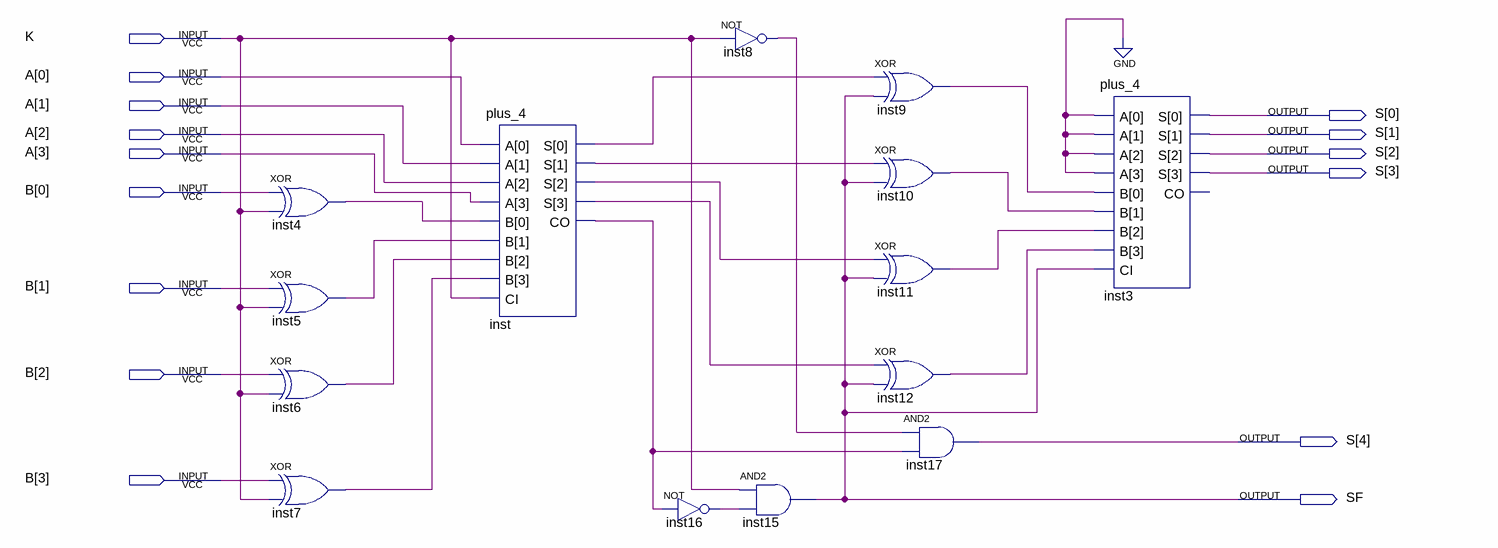
[diagram p0: schematic sheet]
// Quartus schematic plus_minus_final.bdf as structural Verilog: 14 symbols, 15 pins
module plus_minus_final (
  input  K,
  input  [3:0] A,
  input  [3:0] B,
  output [4:0] S,
  output SF
);

  wire inst4_out, inst5_out, inst6_out, inst7_out, inst8_out, inst9_out, inst10_out, inst11_out, inst12_out,
       inst16_out, inst_co, inst_s, inst_s_2, inst_s_3, inst_s_4;

  xor inst4 (inst4_out, B[0], K);
  xor inst5 (inst5_out, B[1], K);
  xor inst6 (inst6_out, B[2], K);
  xor inst7 (inst7_out, B[3], K);
  plus_4 inst (
    .A(A), .B({inst7_out, inst6_out, inst5_out, inst4_out}), .CI(K),
    .S({inst_s_3, inst_s_2, inst_s_4, inst_s}), .CO(inst_co));
  not inst16 (inst16_out, inst_co);
  not inst8 (inst8_out, K);
  and inst15 (SF, K, inst16_out);
  xor inst9 (inst9_out, inst_s, SF);
  xor inst10 (inst10_out, inst_s_4, SF);
  xor inst11 (inst11_out, inst_s_2, SF);
  xor inst12 (inst12_out, inst_s_3, SF);
  and inst17 (S[4], inst8_out, inst_co);
  plus_4 inst3 (.A(4'b0000), .B({inst12_out, inst11_out, inst10_out, inst9_out}), .CI(SF), .S(S[3:0]));  // open: CO
endmodule
